# Altium schematic sheet SmartUrometer_Schematic.SchDoc: Urinometer
size A; DrawnBy: Rivikula Fernando; Address1: Urinometer Weight based model; Revision: A1; SheetNumber: 1; SheetTotal: 1
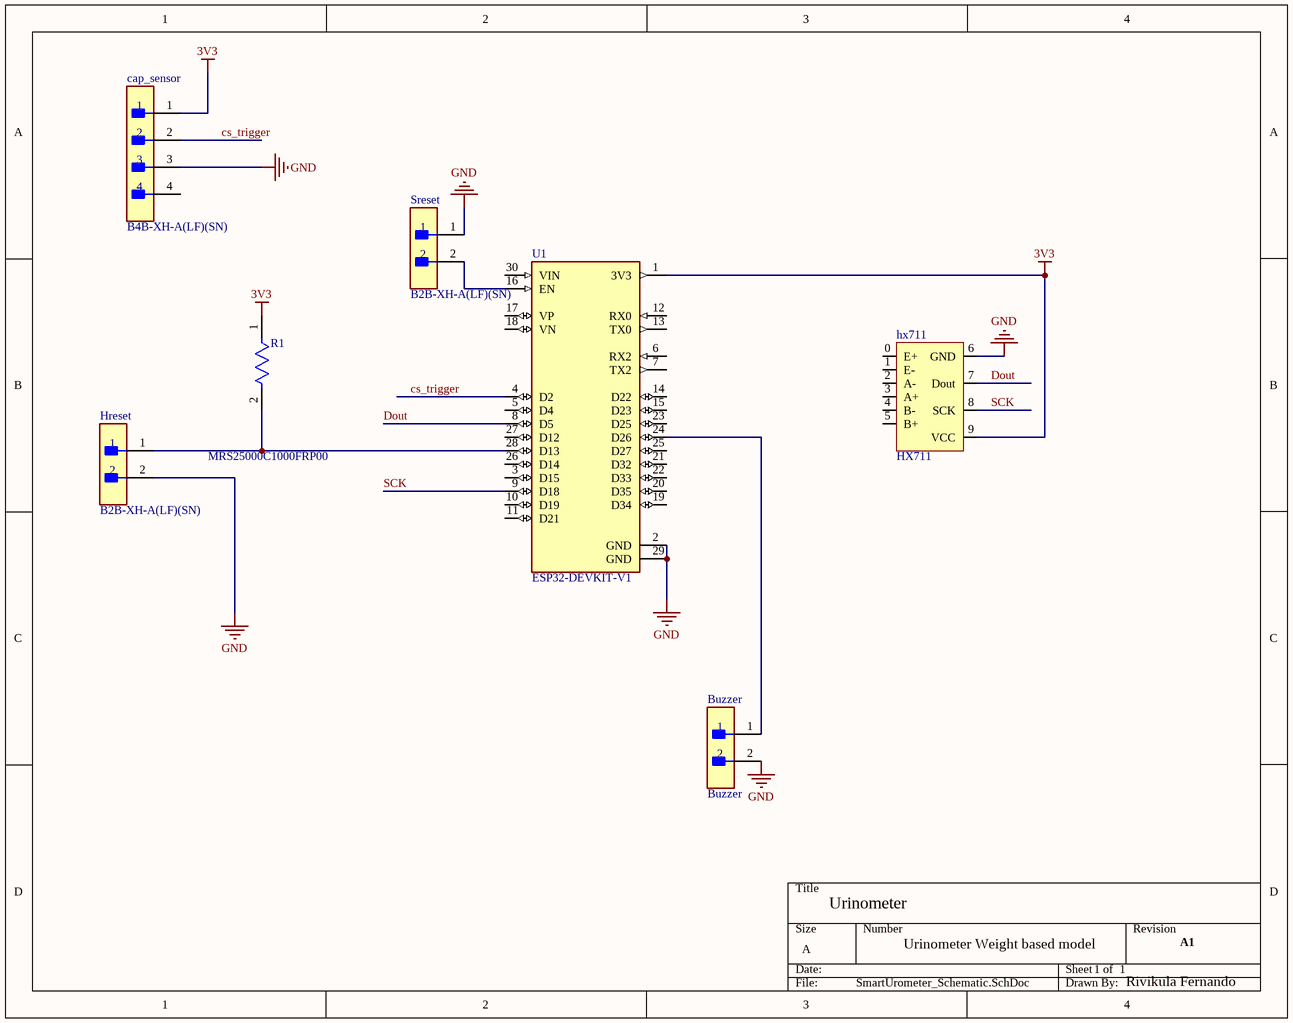
[diagram p0: SmartUrometer_Schematic.SchDoc]

## Parts
Buzzer  Buzzer  [FP-B2B-XH-A_LF_SN-MFG]
cap_sensor  B4B-XH-A(LF)(SN)  [FP-B4B-XH-A_LF_SN-MFG]
Hreset  B2B-XH-A(LF)(SN)  [FP-B2B-XH-A_LF_SN-MFG]
hx711  HX711  [hX711]
R1  MRS25000C1000FRP00  [FP-MRS25-MFG]
Sreset  B2B-XH-A(LF)(SN)  [FP-B2B-XH-A_LF_SN-MFG]
U1  ESP32-DEVKIT-V1  [MODULE_ESP32_DEVKIT_V1]

## Nets
3V3: cap_sensor.1 hx711.9(VCC) R1.1 U1.1(3V3)
GND: Buzzer.2 cap_sensor.3 Hreset.2 hx711.6(GND) Sreset.1 U1.2(GND) U1.29(GND)
cs_trigger: cap_sensor.2 U1.4(D2)
Dout: hx711.7(Dout) U1.8(D5)
SCK: hx711.8(SCK) U1.9(D18)
NetBuzzer_1: Buzzer.1 U1.24(D26)
NetHreset_1: Hreset.1 R1.2 U1.28(D13)
NetSreset_2: Sreset.2 U1.16(EN)

Not connected (* = marked no-connect by the designer): cap_sensor 4; hx711 0(E+) 1(E-) 2(A-) 3(A+) 4(B-) 5(B+); U1 3(D15) 5(D4) 6(RX2) 7(TX2) 10(D19) 11(D21) 12(RX0) 13(TX0) 14(D22) 15(D23) 17(VP) 18(VN) 19(D34) 20(D35) 21(D32) 22(D33) 23(D25) 25(D27) 26(D14) 27(D12) 30(VIN)

## Library data of the parts
Buzzer Hreset Sreset = CMP-2000-05888-3: CONN HEADER VERT 2POS 2.5MM; Current Rating: 3A; Voltage Rating: 250V; Number of Contacts: 2; Contact Resistance: 20mR; Wire/Cable Gauge: 22AWG; Insulation Resistance: 1GR; Connector Type: Male Pin; Packaging: Bulk; Contact Material: Brass; Lead Free: Lead Free; Orientation: Straight; Contact Plating: Tin; Max Current Rating: 3A; Termination: Solder; Fastening Type: Detent; Depth: 5.75mm; Housing Material: Polyamide; REACH SVHC: No SVHC; Series: XH; Voltage Rating (AC): 250V; Number of Positions: 2; Color: Natural; Contact Type: Male Pin; Max Voltage Rating (DC): 250V; Pitch: 2.5mm; Lead Pitch: 2.5mm; Mount: Through Hole; Max Operating Temperature: 85°C; Length: 7.4mm; Max Voltage Rating (AC): 250V; Min Operating Temperature: -25°C; Number of Rows: 1; Housing Color: White
cap_sensor = CMP-17439-000250-1: CONN HEADER VERT 4POS 2.5MM; Number of Contacts: 4; Contact Resistance: 20mR; Voltage Rating: 250V; Max Current Rating: 3A; Gender: Male; Wire/Cable Gauge: 22AWG; Mated Stacking Heights: 9.8mm; Insulation Resistance: 1GR; Orientation: Straight; Contact Type: Male Pin; Contact Finish - Mating: TIN; Series: XH; Max Voltage Rating (AC): 250V; Lead Pitch: 2.5mm; Contact Shape: Square; Insulation Color: Natural; Termination: Solder; Lead Free: Lead Free; Voltage Rating (AC): 250V; Number of Rows: 1; Flammability Rating: UL94 V-0; Number of Positions: 4; Max Operating Temperature: 85°C; Package Quantity: 500; Mount: Through Hole; REACH SVHC: No SVHC; Connector Type: Header; Insulation Material: Nylon; Fastening Type: Detent; Min Operating Temperature: -25°C; Housing Color: White; Packaging: Bulk; Contact Plating: Tin; Contact Material: Brass; Max Voltage Rating (DC): 250V; Housing Material: Polyamide; Color: Natural; Material: Polyamide; Pitch: 2.5mm; Depth: 5.75mm; Current Rating: 3A; Length: 12.4mm
R1 = CMP-00030-42757237-1: MRS25000C1000FRP00 Resistor, 100 Ohm, ± 1%, 600 mW, Axial Leaded, Metal Film (Thin Film), Professional; Max Power Dissipation: 600mW; Resistance: 100Ω; Voltage Rating: 350V; Temperature Coefficient: 50ppm/°C; Lead Diameter: 600µm; RoHS: Compliant; Radiation Hardening: No; Schedule B: 8533210090, 8533210090; Length: 6.5mm; Packaging: Tape & Reel (TR); Number of Terminations: 2; Mount: Through Hole; Width: 2.5mm; Tolerance: 1%; Military Standard: Not; Voltage Rating (DC): 350V; Contact Plating: Tin; Number of Pins: 2; Max Operating Temperature: 155°C; NexarPartId: 42757237; Diameter: 2.5mm; Composition: Metal Film, Thin Film; REACH SVHC: Unknown; Power Rating: 600mW; Lead Free: Lead Free; Termination: Axial; Case/Package: Axial; Min Operating Temperature: -55°C
U1 = CMP-008-000000-1: Dual core, Wi-Fi: 2.4 GHz up to 150 Mbits/s,BLE (Bluetooth Low Energy) and legacy Bluetooth, 32 bits, Up to 240 MHz; MF: Do it; Availability: Not in stock; Pin Count: 30; MP: ESP32-DEVKIT-V1; Check_prices: https://www.snapeda.com/parts/ESP32-DEVKIT-V1/Do+it/view-part/?ref=eda; Component Type: Standard; Value: *; SnapEDA_Link: https://www.snapeda.com/parts/ESP32-DEVKIT-V1/Do+it/view-part/?ref=snap; Price: None; Source: ESP32-DEVKIT-V1.SchLib; Design Item ID: ESP32-DEVKIT-V1; Package: None